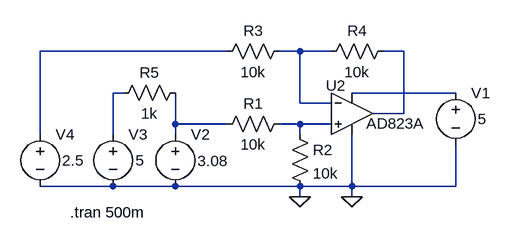
[diagram p0: schematic amp_diferencial.asc]
amp_diferencial.asc, the LTspice schematic file:
Version 4
SHEET 1 880 680
WIRE -64 112 -352 112
WIRE 48 112 16 112
WIRE 96 112 48 112
WIRE 208 112 176 112
WIRE -224 176 -240 176
WIRE 288 176 128 176
WIRE 48 192 48 112
WIRE 96 192 48 192
WIRE 208 208 208 112
WIRE 208 208 160 208
WIRE -144 224 -144 176
WIRE -64 224 -144 224
WIRE 48 224 16 224
WIRE 96 224 48 224
WIRE -352 240 -352 112
WIRE -240 240 -240 176
WIRE -144 240 -144 224
WIRE 48 240 48 224
WIRE -240 320 -352 320
WIRE -144 320 -240 320
WIRE 48 320 -144 320
WIRE 128 320 128 240
WIRE 128 320 48 320
WIRE 288 320 288 256
WIRE 288 320 128 320
WIRE 48 336 48 320
WIRE 128 336 128 320
FLAG 48 336 0
FLAG 128 336 0
SYMBOL res 32 208 R90
WINDOW 0 0 56 VBottom 2
WINDOW 3 32 56 VTop 2
SYMATTR InstName R1
SYMATTR Value 10k
SYMBOL res 32 224 R0
SYMATTR InstName R2
SYMATTR Value 10k
SYMBOL res 32 96 R90
WINDOW 0 0 56 VBottom 2
WINDOW 3 32 56 VTop 2
SYMATTR InstName R3
SYMATTR Value 10k
SYMBOL res 192 96 R90
WINDOW 0 0 56 VBottom 2
WINDOW 3 32 56 VTop 2
SYMATTR InstName R4
SYMATTR Value 10k
SYMBOL voltage 288 160 R0
WINDOW 3 34 56 Left 2
WINDOW 123 0 0 Left 0
WINDOW 39 0 0 Left 0
SYMATTR InstName V1
SYMATTR Value 5
SYMBOL voltage -144 224 R0
WINDOW 3 34 57 Left 2
WINDOW 123 0 0 Left 0
WINDOW 39 0 0 Left 0
SYMATTR InstName V2
SYMATTR Value 3.08
SYMBOL OpAmps\\AD823A 128 144 R0
WINDOW 0 -40 21 Left 2
WINDOW 3 22 79 Left 2
SYMATTR InstName U2
SYMBOL voltage -240 224 R0
WINDOW 3 35 56 Left 2
WINDOW 123 0 0 Left 0
WINDOW 39 0 0 Left 0
SYMATTR InstName V3
SYMATTR Value 5
SYMBOL res -128 160 R90
WINDOW 0 0 56 VBottom 2
WINDOW 3 32 56 VTop 2
SYMATTR InstName R5
SYMATTR Value 1k
SYMBOL voltage -352 224 R0
WINDOW 3 34 56 Left 2
WINDOW 123 0 0 Left 0
WINDOW 39 0 0 Left 0
SYMATTR InstName V4
SYMATTR Value 2.5
TEXT -306 360 Left 2 !.tran 500m

The netlist it stands for:
* amp_diferencial.asc
R1 N007 N006 10k
R2 N007 0 10k
R3 N002 N001 10k
R4 N003 N002 10k
V1 N005 0 5
V2 N006 0 3.08
XU2 N007 N002 N005 0 N003 AD823A  ; pins In+ In- V+ V- OUT
V3 N004 0 5
R5 N006 N004 1k
V4 N001 0 2.5
.tran 500m
.backanno
.end